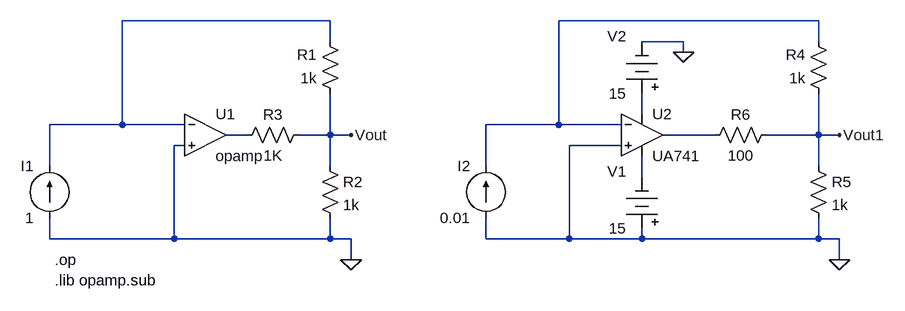
[diagram p0: schematic g3_p24.asc]
g3_p24.asc, the LTspice schematic file:
Version 4
SHEET 1 1220 680
WIRE 352 -32 32 -32
WIRE 1104 -32 704 -32
WIRE 352 0 352 -32
WIRE 896 0 832 0
WIRE 1104 0 1104 -32
WIRE 896 16 896 0
WIRE 832 112 832 80
WIRE 32 128 32 -32
WIRE 32 128 -80 128
WIRE 128 128 32 128
WIRE 704 128 704 -32
WIRE 704 128 592 128
WIRE 800 128 704 128
WIRE 224 144 192 144
WIRE 352 144 352 80
WIRE 352 144 304 144
WIRE 384 144 352 144
WIRE 944 144 864 144
WIRE 1104 144 1104 80
WIRE 1104 144 1024 144
WIRE 1136 144 1104 144
WIRE 128 160 112 160
WIRE 800 160 720 160
WIRE -80 192 -80 128
WIRE 352 192 352 144
WIRE 592 192 592 128
WIRE 1104 192 1104 144
WIRE 832 208 832 176
WIRE -80 304 -80 272
WIRE 112 304 112 160
WIRE 112 304 -80 304
WIRE 352 304 352 272
WIRE 352 304 112 304
WIRE 384 304 352 304
WIRE 592 304 592 272
WIRE 720 304 720 160
WIRE 720 304 592 304
WIRE 832 304 832 288
WIRE 832 304 720 304
WIRE 1104 304 1104 272
WIRE 1104 304 832 304
WIRE 1136 304 1104 304
WIRE 384 336 384 304
WIRE 1136 336 1136 304
FLAG 384 336 0
FLAG 384 144 Vout
FLAG 1136 336 0
FLAG 1136 144 Vout1
FLAG 896 16 0
SYMBOL Opamps\\opamp 160 80 R0
SYMATTR InstName U1
SYMBOL res 368 96 R180
WINDOW 0 36 76 Left 2
WINDOW 3 36 40 Left 2
SYMATTR InstName R1
SYMATTR Value 1k
SYMBOL current -80 272 R180
WINDOW 0 24 80 Left 2
WINDOW 3 24 0 Left 2
SYMATTR InstName I1
SYMATTR Value 1
SYMBOL res 336 176 R0
SYMATTR InstName R2
SYMATTR Value 1k
SYMBOL res 320 128 R90
WINDOW 0 0 56 VBottom 2
WINDOW 3 32 56 VTop 2
SYMATTR InstName R3
SYMATTR Value 1K
SYMBOL res 1120 96 R180
WINDOW 0 36 76 Left 2
WINDOW 3 36 40 Left 2
SYMATTR InstName R4
SYMATTR Value 1k
SYMBOL current 592 272 R180
WINDOW 0 24 80 Left 2
WINDOW 3 24 0 Left 2
SYMATTR InstName I2
SYMATTR Value 0.01
SYMBOL res 1088 176 R0
SYMATTR InstName R5
SYMATTR Value 1k
SYMBOL res 1040 128 R90
WINDOW 0 0 56 VBottom 2
WINDOW 3 32 56 VTop 2
SYMATTR InstName R6
SYMATTR Value 100
SYMBOL AutoGenerated\\UA741 832 144 R0
SYMATTR InstName U2
SYMBOL Misc\\battery 832 304 R180
WINDOW 0 24 104 Left 2
WINDOW 3 24 16 Left 2
SYMATTR InstName V1
SYMATTR Value 15
SYMBOL Misc\\battery 832 96 R180
WINDOW 0 24 104 Left 2
WINDOW 3 24 16 Left 2
SYMATTR InstName V2
SYMATTR Value 15
TEXT -72 336 Left 2 !.op
TEXT -72 368 Left 2 !.lib opamp.sub

The netlist it stands for:
* g3_p24.asc
XU1 N001 0 N004 opamp Aol=100K GBW=10Meg  ; pins invin noninvin out
R1 Vout N001 1k
I1 0 N001 1
R2 Vout 0 1k
R3 Vout N004 1K
R4 Vout1 N002 1k
I2 0 N002 0.01
R5 Vout1 0 1k
R6 Vout1 N005 100
* U2: UA741 (symbol AutoGenerated\UA741 not available, pins judged from their places): In+=0 In-=N002 V+=N003 V-=N006 OUT=N005
V1 0 N006 15
V2 N003 0 15
.op
.lib opamp.sub
.backanno
.end